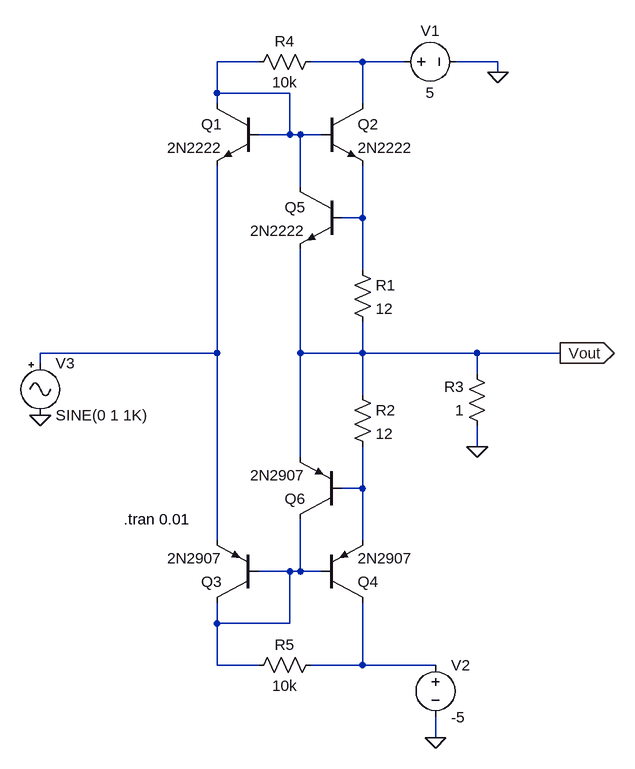
[diagram p0: schematic block3_10k.asc]
block3_10k.asc, the LTspice schematic file:
Version 4
SHEET 1 900 864
WIRE 336 -192 272 -192
WIRE 496 -192 416 -192
WIRE 560 -192 496 -192
WIRE 704 -192 640 -192
WIRE 704 -176 704 -192
WIRE 272 -144 272 -192
WIRE 384 -144 272 -144
WIRE 272 -128 272 -144
WIRE 496 -128 496 -192
WIRE 384 -80 384 -144
WIRE 384 -80 336 -80
WIRE 400 -80 384 -80
WIRE 432 -80 400 -80
WIRE 400 0 400 -80
WIRE 496 48 496 -32
WIRE 496 48 464 48
WIRE 496 128 496 48
WIRE 272 256 272 -32
WIRE 272 256 0 256
WIRE 400 256 400 96
WIRE 496 256 496 208
WIRE 496 256 400 256
WIRE 672 256 496 256
WIRE 800 256 672 256
WIRE 0 272 0 256
WIRE 672 288 672 256
WIRE 496 320 496 256
WIRE 672 400 672 368
WIRE 400 416 400 256
WIRE 496 464 496 400
WIRE 496 464 464 464
WIRE 272 544 272 256
WIRE 496 544 496 464
WIRE 384 592 336 592
WIRE 400 592 400 512
WIRE 400 592 384 592
WIRE 432 592 400 592
WIRE 272 672 272 640
WIRE 384 672 384 592
WIRE 384 672 272 672
WIRE 272 736 272 672
WIRE 336 736 272 736
WIRE 496 736 496 640
WIRE 496 736 416 736
WIRE 608 736 496 736
WIRE 608 848 608 816
FLAG 704 -176 0
FLAG 608 848 0
FLAG 0 352 0
FLAG 800 256 Vout
IOPIN 800 256 Out
FLAG 672 400 0
SYMBOL voltage 544 -192 R270
WINDOW 0 32 56 VTop 2
WINDOW 3 -32 56 VBottom 2
SYMATTR InstName V1
SYMATTR Value 5
SYMBOL npn 336 -128 M0
SYMATTR InstName Q1
SYMATTR Value 2N2222
SYMBOL npn 432 -128 R0
SYMATTR InstName Q2
SYMATTR Value 2N2222
SYMBOL pnp 336 640 R180
SYMATTR InstName Q3
SYMATTR Value 2N2907
SYMBOL pnp 432 640 M180
SYMATTR InstName Q4
SYMATTR Value 2N2907
SYMBOL voltage 608 720 R0
SYMATTR InstName V2
SYMATTR Value -5
SYMBOL Misc/signal 0 256 R0
SYMATTR InstName V3
SYMBOL npn 464 0 M0
SYMATTR InstName Q5
SYMATTR Value 2N2222
SYMBOL res 480 112 R0
SYMATTR InstName R1
SYMATTR Value 12
SYMBOL pnp 464 512 R180
SYMATTR InstName Q6
SYMATTR Value 2N2907
SYMBOL res 480 304 R0
SYMATTR InstName R2
SYMATTR Value 12
SYMBOL res 432 -208 R90
WINDOW 0 0 56 VBottom 2
WINDOW 3 32 56 VTop 2
SYMATTR InstName R4
SYMATTR Value 10k
SYMBOL res 432 720 R90
WINDOW 0 0 56 VBottom 2
WINDOW 3 32 56 VTop 2
SYMATTR InstName R5
SYMATTR Value 10k
SYMBOL res 688 384 R180
WINDOW 0 36 76 Left 2
WINDOW 3 36 40 Left 2
SYMATTR InstName R3
SYMATTR Value 1
TEXT 128 512 Left 2 !.tran 0.01

The netlist it stands for:
* block3_10k.asc
V1 N002 0 5
Q1 N001 N001 N004 0 2N2222
Q2 N002 N001 N003 0 2N2222
Q3 N006 N006 N004 0 2N2907
Q4 N007 N006 N005 0 2N2907
V2 N007 0 -5
V3 N004 0 SINE(0 1 1K)
Q5 N001 N003 Vout 0 2N2222
R1 N003 Vout 12
Q6 N006 N005 Vout 0 2N2907
R2 Vout N005 12
R4 N002 N001 10k
R5 N007 N006 10k
R3 0 Vout 1
.model NPN NPN
.model PNP PNP
.lib standard.bjt
.tran 0.01
.backanno
.end